# Altium schematic sheet Main.SchDoc
size A; SheetNumber: 1; SheetTotal: 1
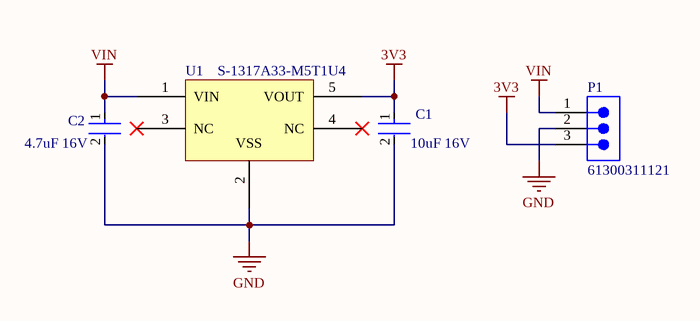
[diagram p0: Main.SchDoc]

## Parts
C1  10uF 16V  [FP-CC0603-DC-MFG]
C2  4.7uF 16V  [FP-CC0603-DA-MFG]
P1  61300311121  [61300311121]
U1  S-1317A33-M5T1U4  [S-1317A33-M5T1U4]

## Nets
3V3: C1.1 P1.3 U1.5(VOUT)
GND: C1.2 C2.2 P1.2 U1.2(VSS)
VIN: C2.1 P1.1 U1.1(VIN)

Not connected (* = marked no-connect by the designer): U1 3(NC)* 4(NC)*

## Library data of the parts
C1 = CMP-00621-81932632-1: CM105X5R106K16AT; Capacitance: 10µF; Dielectric: X5R; Material: Ceramic; Tolerance: 10%; NexarPartId: 81932632; Height: 1mm; Halogen Free: Halogen Free; Voltage Rating: 16V; Max Operating Temperature: 85°C; Voltage Rating (DC): 16V; Lead Free: Lead Free; RoHS: Non-Compliant; Min Operating Temperature: -55°C; Case/Package: 0603
C2 = CMP-03422-001236-1: GRM188Z71C475KE21D; Manufacturer: YAGEO; Manufacturer Part Number: CC0603KRX5R7BB475; Temperature Characteristic: X5R; Temperature Coefficient: 15%; Material: Ceramic; Description: CC0603 4.7 uF X5R 10.00% 16 V; Tolerance: 0.1; Footprint Url: http://www.yageo.com/exep/pages/download/literatures/UPY-C_GEN_24.pdf; Device Class L3: Ceramic Capacitors; Category: Cap; Voltage Rating: 16 V; Automotive: No; Temperature Range High: +125°C; Value: 4.7 uF; Device Class L1: Passive Components; RoHS: TRUE; Device Class L2: Capacitors; Voltage: 16 V; Height: 0.9mm; Temperature Range Low: -55°C; Temperature: -55°C to +125°C; Capacitance: 4.7 uF; Mouser Description: Multilayer Ceramic Capacitors MLCC - SMD/SMT 4.7uF 16V X5R 10%; Octopart: https://octopart.com/cc0603krx5r7bb475-yageo-34978295; Package: CC0603-DA; Lead Free: Yes; Digikey Description: CAP CER 4.7UF 16V X5R 0603
P1 = CMP-1502-01062-4: THT Vertical Pin Header WR-PHD, Pitch 2.54 mm, Single Row, 3 pins; Connector Type: Male Pin; Number of Contacts: 3; Operating Supply Voltage: 250V; Current Rating: 3A; Pitch: 2.54mm; Contact Resistance: 20mΩ; Gender: Male; Height: 8.94mm; Color: Black; Min Operating Temperature: -40°C; Max Operating Temperature: 105°C; Mount: Through Hole; Termination: Solder; Number of Rows: 1; Packaging: Bulk; Number of Pins: 3; Lead Pitch: 2.54mm; RoHS: Compliant; Contact Plating: Gold; Number of Positions: 3; Lead Free: Lead Free; Voltage Rating: 250V; Contact Mating Length: 5.9944mm; Orientation: Vertical; Contact Material: Gold